# EAGLE design TDC1000_Front_End_AutoRoute (EAGLE 9.3.0)
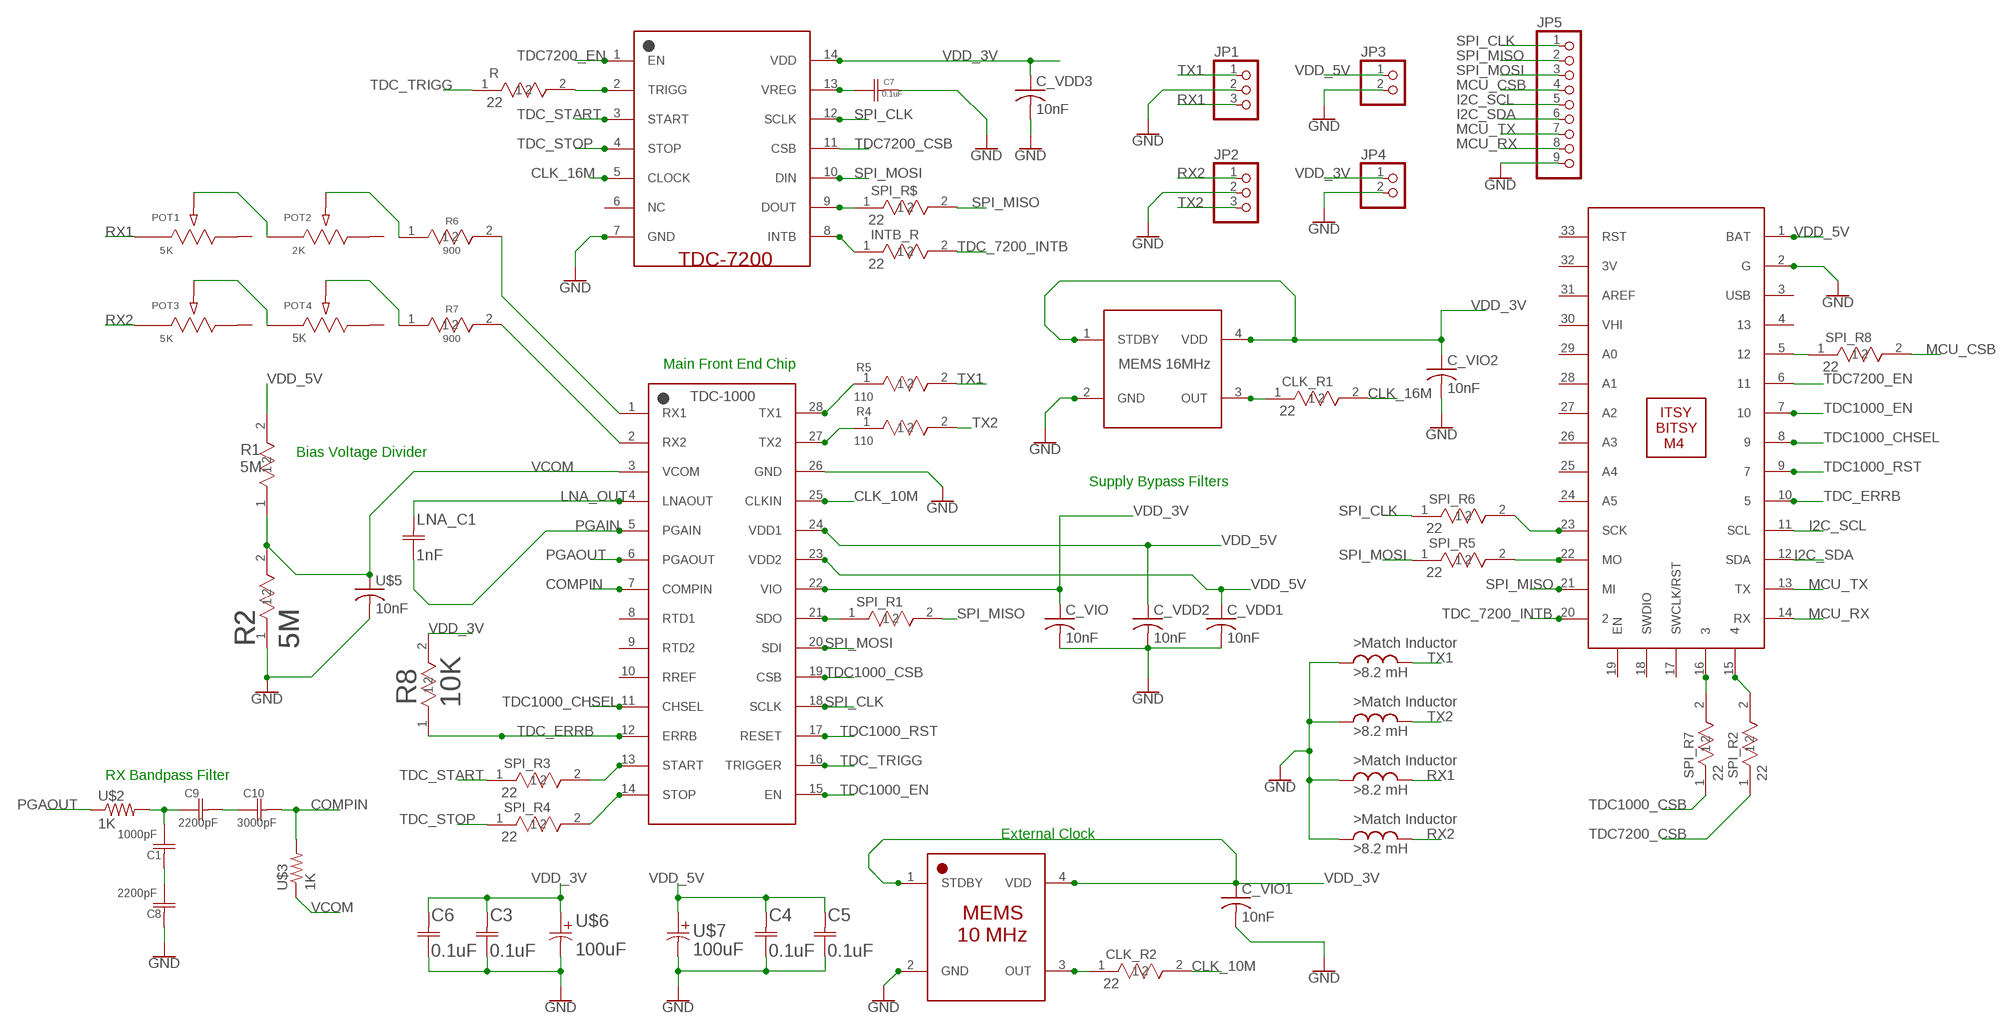
[diagram p0: schematic, sheet 1]

## Parts
C1  1000pF  06035C104JAT2A  [0603]
C3  0.1uF  06035C104JAT2A  [0603]
C4  0.1uF  06035C104JAT2A  [0603]
C5  0.1uF  06035C104JAT2A  [0603]
C6  0.1uF  06035C104JAT2A  [0603]
C7  0.1uF  06035C104JAT2A  [0603]
C8  2200pF  06035C104JAT2A  [0603]
C9  2200pF  06035C104JAT2A  [0603]
C10  3000pF  06035C104JAT2A  [0603]
C_VDD1  10nF  CL05B103KB5NNNC  [CL05B103KB5NNNC]
C_VDD2  10nF  CL05B103KB5NNNC  [CL05B103KB5NNNC]
C_VDD3  10nF  CL05B103KB5NNNC  [CL05B103KB5NNNC]
C_VIO  10nF  CL05B103KB5NNNC  [CL05B103KB5NNNC]
C_VIO1  10nF  CL05B103KB5NNNC  [CL05B103KB5NNNC]
C_VIO2  10nF  CL05B103KB5NNNC  [CL05B103KB5NNNC]
CLK_R1  22  MMB02070C2209FB200  [MMB0207]
CLK_R2  22  MMB02070C2209FB200  [MMB0207]
INTB_R  22  MMB02070C2209FB200  [MMB0207]
JP1  PINHD-1X3/90  [1X03/90]
JP2  PINHD-1X3/90  [1X03/90]
JP3  PINHD-1X2/90  [1X02/90]
JP4  PINHD-1X2/90  [1X02/90]
JP5  PINHD-1X9  [1X09]
LNA_C1  1nF  06035C104JAT2A  [0603]
POT1  5K  3362P-1-502LF  [POT_3362P]
POT2  2K  3362P-1-502LF  [POT_3362P]
POT3  5K  3362P-1-502LF  [POT_3362P]
POT4  5K  3362P-1-502LF  [POT_3362P]
R  22  MMB02070C2209FB200  [MMB0207]
R1  5M  PAT1206E9000BST1  [1206]
R2  5M  PAT1206E9000BST1  [1206]
R4  110  RR1220P-111-D  [RES_1220]
R5  110  RR1220P-111-D  [RES_1220]
R6  900  PAT1206E9000BST1  [1206]
R7  900  PAT1206E9000BST1  [1206]
R8  10K  RR0816P-103-D  [RES_0816]
SPI_R1  22  MMB02070C2209FB200  [MMB0207]
SPI_R2  22  MMB02070C2209FB200  [MMB0207]
SPI_R3  22  MMB02070C2209FB200  [MMB0207]
SPI_R4  22  MMB02070C2209FB200  [MMB0207]
SPI_R5  22  MMB02070C2209FB200  [MMB0207]
SPI_R6  22  MMB02070C2209FB200  [MMB0207]
SPI_R7  22  MMB02070C2209FB200  [MMB0207]
SPI_R8  22  MMB02070C2209FB200  [MMB0207]
SPI_R$  22  MMB02070C2209FB200  [MMB0207]
U$1  TDC1000_TSSOP  [TDC1000_TSSOP]
U$2  1K  ESR03_1K_RESISTOR  [ROHM_ESR03]
U$3  1K  ESR03_1K_RESISTOR  [ROHM_ESR03]
U$4  DSC1001CL5-010.0000_2.5X10MHZ_2.5X3.2MM  [DSC1001CL5-010.0000_2.5X3.2MM]
U$5  10nF  CL05B103KB5NNNC  [CL05B103KB5NNNC]
U$6  100uF  UKL1E101KPDANATA_100UF_CAP  [UKL1E101KPDANATA_100UF]
U$7  100uF  UKL1E101KPDANATA_100UF_CAP  [UKL1E101KPDANATA_100UF]
U$8  TDC7200_TSSOPTSSOP-14  [TDC7200_TSSOP]
U$9  DSC1001BL5-016.0000_5X3.2MM  [DSC1001BL5-016.0000_5X3.2MM]
U$10  ITSY_BITSY_M4  [ITSY_BITSY_M4]
U$11  AIUR_16_8.2MH_INDUCTOR  [AIUR-16_8MH_INDUCTOR]
U$12  AIUR_16_8.2MH_INDUCTOR  [AIUR-16_8MH_INDUCTOR]
U$13  AIUR_16_8.2MH_INDUCTOR  [AIUR-16_8MH_INDUCTOR]
U$14  AIUR_16_8.2MH_INDUCTOR  [AIUR-16_8MH_INDUCTOR]

## Nets
CLK_10M: CLK_R2.2 U$1.25(CLKIN)
CLK_16M: CLK_R1.2 U$8.5(CLOCK)
COMPIN: C10.2 U$1.7(COMPIN) U$3.P$2
GND: C3.1 C4.1 C5.1 C6.1 C7.2 C8.2 C_VDD1.2 C_VDD2.2 C_VDD3.2 C_VIO1.2 C_VIO2.2 C_VIO.2 JP1.2 JP2.2 JP3.2 JP4.2 JP5.9 R2.1 U$1.26(GND) U$4.2(GND) U$5.2 U$6.1 U$7.1 U$8.7(GND) U$9.2(GND) U$10.2(G) U$11.1 U$12.1 U$13.1 U$14.1
I2C_SCL: JP5.5 U$10.11(SCL)
I2C_SDA: JP5.6 U$10.12(SDA)
LNA_OUT: LNA_C1.2 U$1.4(LNAOUT)
MCU_CSB: JP5.4 SPI_R8.2
MCU_RX: JP5.8 U$10.14(RX)
MCU_TX: JP5.7 U$10.13(TX)
N$1: SPI_R1.1 U$1.21(SDO)
N$2: SPI_R2.2 U$10.15
N$3: R.2 U$8.2(TRIGG)
N$4: SPI_R3.2 U$1.13(START)
N$5: SPI_R8.1 U$10.5
N$6: CLK_R2.1 U$4.3(OUT)
N$8: C1.1 C9.1 U$2.P$2
N$9: R5.1 U$1.28(TX1)
N$10: C9.2 C10.1
N$11: R4.1 U$1.27(TX2)
N$12: SPI_R4.2 U$1.14(STOP)
N$13: SPI_R$.1 U$8.9(DOUT)
N$14: INTB_R.1 U$8.8(INTB)
N$15: SPI_R6.2 U$10.23(SCK)
N$16: SPI_R5.2 U$10.22(MO)
N$17: CLK_R1.1 U$9.3(OUT)
N$18: C7.1 U$8.13(VREG)
N$19: SPI_R7.2 U$10.16
N$20: POT4.2 R7.1
N$21: POT3.2 POT4.1
N$22: R7.2 U$1.2(RX2)
N$23: R6.2 U$1.1(RX1)
N$24: POT1.2 POT2.1
N$25: POT2.2 R6.1
N$26: C1.2 C8.1
PGAIN: LNA_C1.1 U$1.5(PGAIN)
PGAOUT: U$1.6(PGAOUT) U$2.P$1
RX1: JP1.3 POT1.1 U$14.2
RX2: JP2.1 POT3.1 U$13.2
SPI_CLK: JP5.1 SPI_R6.1 U$1.18(SCLK) U$8.12(SCLK)
SPI_MISO: JP5.2 SPI_R1.2 SPI_R$.2 U$10.21(MI)
SPI_MOSI: JP5.3 SPI_R5.1 U$1.20(SDI) U$8.10(DIN)
TDC1000_CHSEL: U$1.11(CHSEL) U$10.8
TDC1000_CSB: SPI_R7.1 U$1.19(CSB)
TDC1000_EN: U$1.15(EN) U$10.7
TDC1000_RST: U$1.17(RESET) U$10.9
TDC7200_CSB: SPI_R2.1 U$8.11(CSB)
TDC7200_EN: U$8.1(EN) U$10.6
TDC_7200_INTB: INTB_R.2 U$10.20
TDC_ERRB: R8.1 U$1.12(ERRB) U$10.10
TDC_START: SPI_R3.1 U$8.3(START)
TDC_STOP: SPI_R4.1 U$8.4(STOP)
TDC_TRIGG: R.1 U$1.16(TRIGGER)
TX1: JP1.1 R5.2 U$12.2
TX2: JP2.3 R4.2 U$11.2
VCOM: R1.1 R2.2 U$1.3(VCOM) U$3.P$1 U$5.1
VDD_3V: C3.2 C6.2 C_VDD3.1 C_VIO1.1 C_VIO2.1 C_VIO.1 JP4.1 R8.2 U$1.22(VIO) U$4.1(STDBY) U$4.4(VDD) U$6.2 U$8.14(VDD) U$9.1(STDBY) U$9.4(VDD)
VDD_5V: C4.2 C5.2 C_VDD1.1 C_VDD2.1 JP3.1 R1.2 U$1.23(VDD2) U$1.24(VDD1) U$7.2 U$10.1(BAT)
Unconnected: POT1.3 POT2.3 POT3.3 POT4.3 U$1.8(RTD1) U$1.9(RTD2) U$1.10(RREF) U$8.6(NC) U$10.3(USB) U$10.4 U$10.17(SWCLK/RST) U$10.18(SWDIO) U$10.19(EN) U$10.24(A5) U$10.25(A4) U$10.26(A3) U$10.27(A2) U$10.28(A1) U$10.29(A0) U$10.30(VHI) U$10.31(AREF) U$10.32(3V) U$10.33(RST)

## Notes on the sheet
- Main Front End Chip
- Bias Voltage Divider
- Supply Bypass Filters
- RX Bandpass Filter
- External Clock

## Library data of the parts
C1 C3-C10 LNA_C1 = Ultrasonic Misc PieceParts:06035C104JAT2A; MANUFACTURER_PART_NUMBER: 06035C104JAT2A; VENDOR: AVX Corporation
C_VDD1-C_VDD3 C_VIO C_VIO1 C_VIO2 U$5 = Ultrasonic Misc PieceParts:CL05B103KB5NNNC
CLK_R1 CLK_R2 INTB_R R SPI_R1-SPI_R8 SPI_R$ = Ultrasonic Misc PieceParts:MMB02070C2209FB200; MANUFACTURER_PART_NUMBER: MMB02070C2209FB200; VENDOR: Vishay
JP1 JP2 = pinhead:PINHD-1X3: PIN HEADER
JP3 JP4 = pinhead:PINHD-1X2: PIN HEADER
JP5 = pinhead:PINHD-1X9: PIN HEADER
POT1-POT4 = Ultrasonic Misc PieceParts:3362P-1-502LF; MANUFACTURER_PART_NUMBER: 3362P1502LF; VENDOR: Bourns Electronics
R1 R2 R6 R7 = Ultrasonic Misc PieceParts:PAT1206E9000BST1; MANUFACTURER_PART_NUMBER: PAT1206E9000BST1; VENDOR: Vishay
R4 R5 = Ultrasonic Misc PieceParts:RR1220P-111-D; MANUFACTURER_PART_NUMBER: RR1220P111D; VENDOR: Susumu
R8 = Ultrasonic Misc PieceParts:RR0816P-103-D; MANUFACTURER_PART_NUMBER: RR0816P103D; VENDOR: Susumu
U$1 = Texas Instruments:TDC1000_TSSOP
U$2 U$3 = Ultrasonic Misc PieceParts:ESR03_1K_RESISTOR
U$4 = MicroChip Technology:DSC1001CL5-010.0000_2.5X
U$6 U$7 = Ultrasonic Misc PieceParts:UKL1E101KPDANATA_100UF_CAP
U$8 = Texas Instruments:TDC7200_TSSOP
U$9 = MicroChip Technology:DSC1001BL5-016.0000_5X3.2MM: A 16MHz MEMS Oscillator (5x3.2mm) by MicroChip Technology
U$10 = Adafruit_Arduino:ITSY_BITSY_M4
U$11-U$14 = Ultrasonic Misc PieceParts:AIUR_16_8.2MH_INDUCTOR

## Board
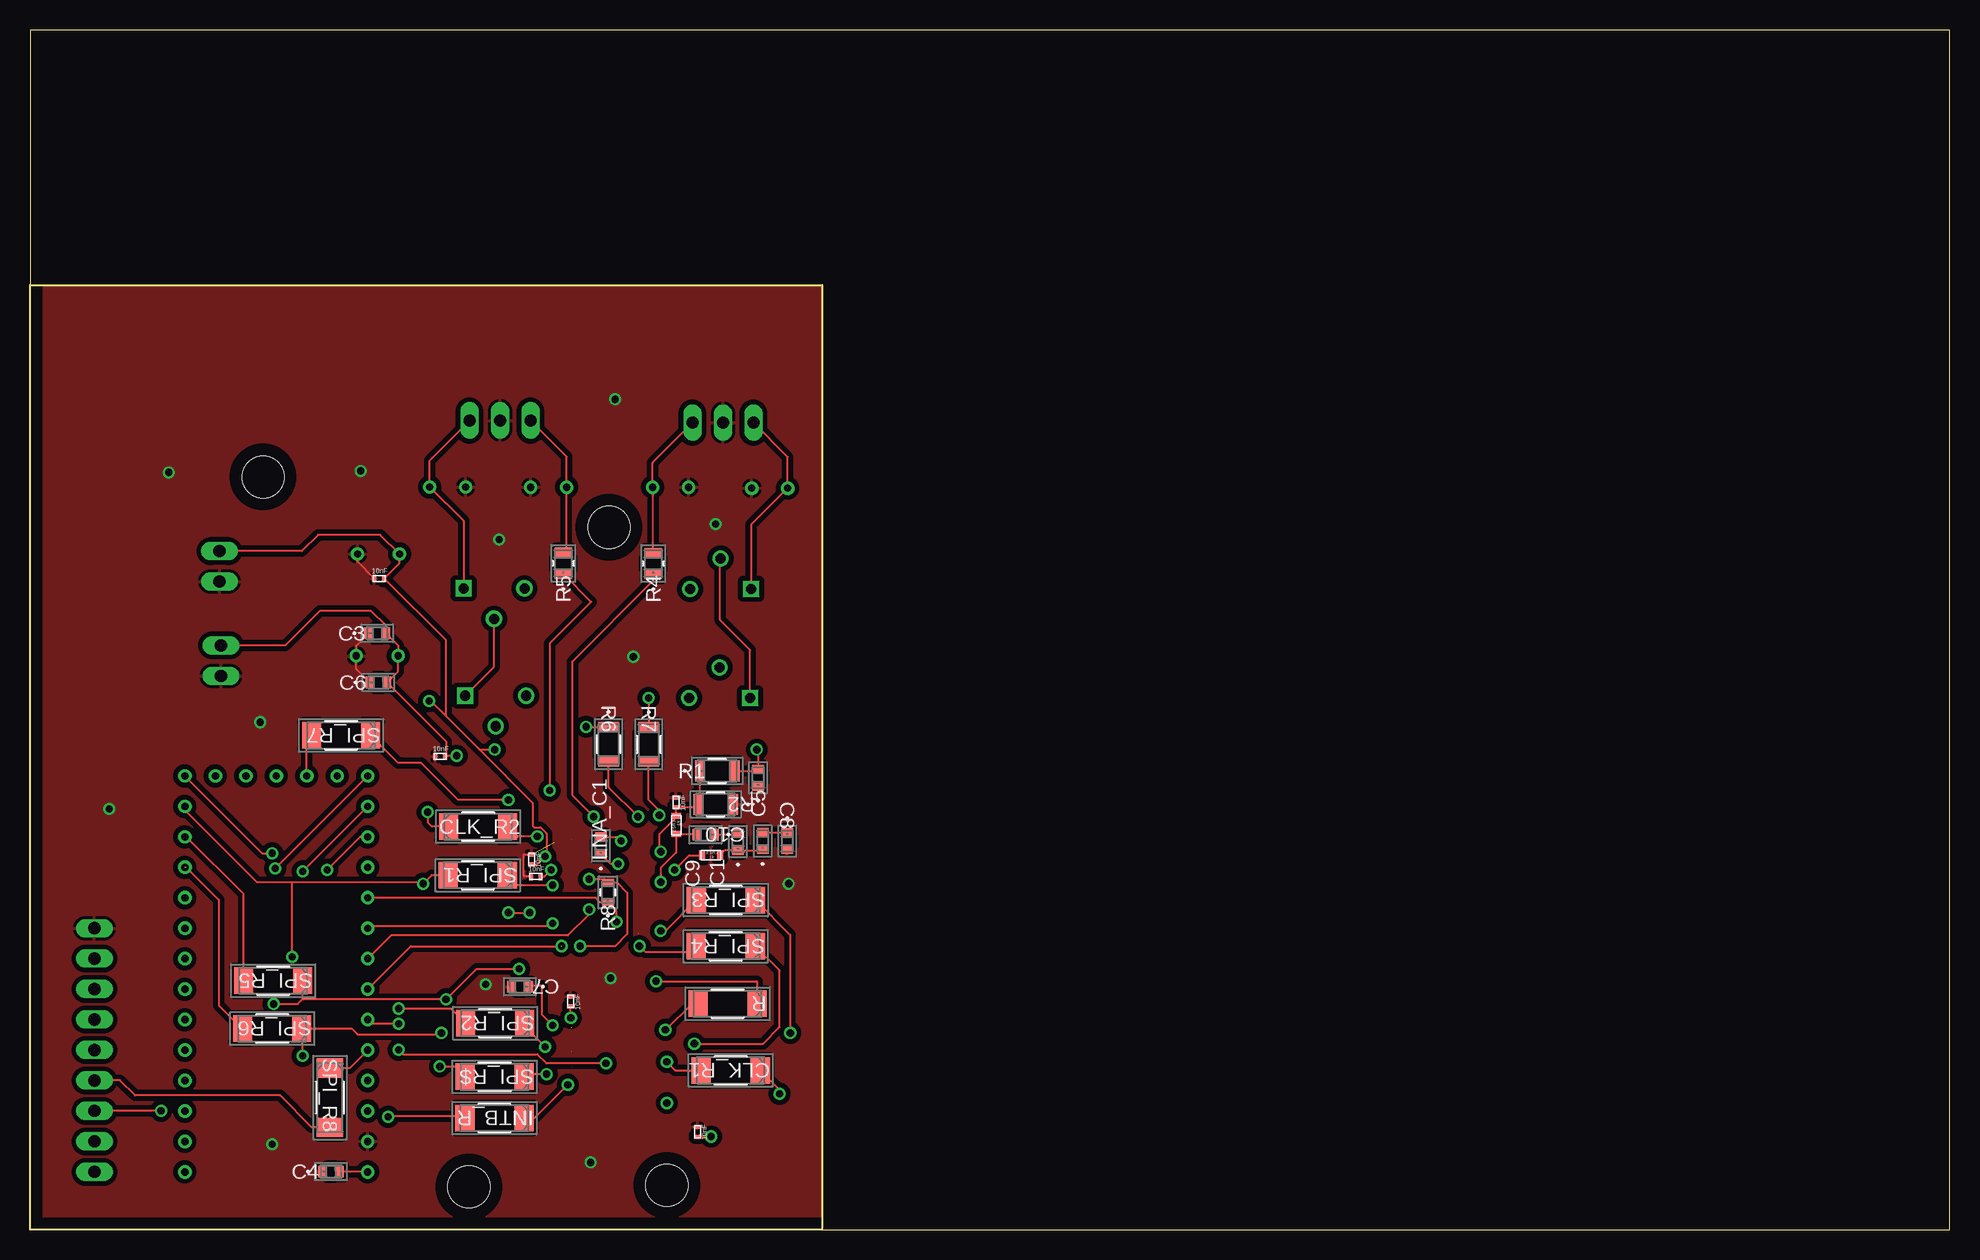
[diagram p1: board, top side]
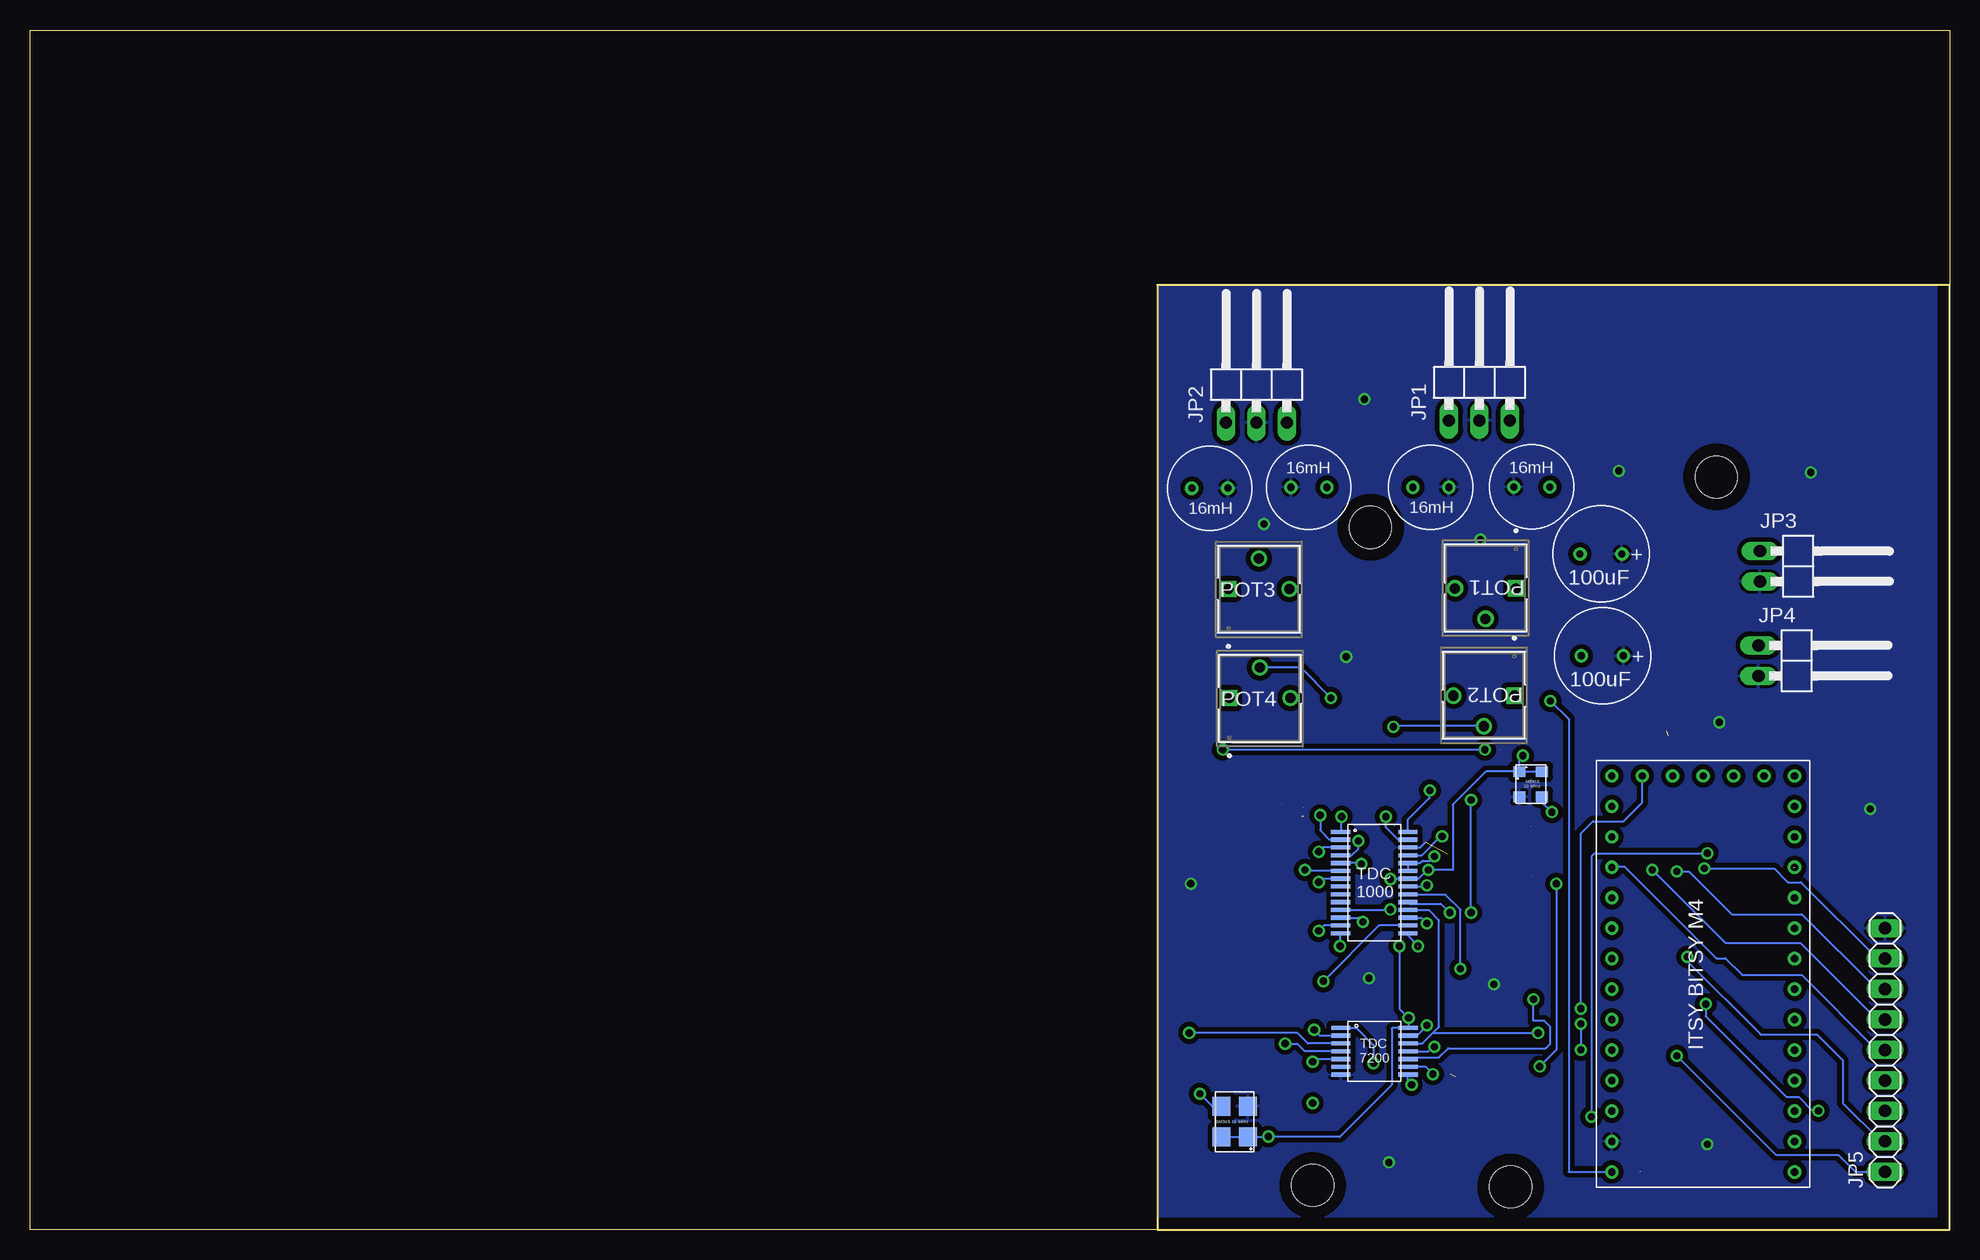
[diagram p2: board, bottom side, seen from below]

Size 160 x 100 mm. Coordinates in mm from the lower left corner, seen from the top.
Outline: 0,0 160,0 160,100 0,100 0,0
Copper layers (1*16): Top 0.035mm / dielectric 1.5mm / Bottom 0.035mm
Design rules "default *": minimum track width 5mil, minimum drill 0.35mm, track to track 5mil, track to pad 5mil, pad to pad 5mil, via to via 5mil, smd to smd 5mil, copper to edge 40mil, drill to drill 6mil, minimum pad ring 10mil, minimum via ring 8mil, stop-mask expansion 4mil, vias tented up to drill 0mil, thermal gap 10mil
Holes 3.5 mm at 36.58,3.56 48.26,58.55 53.09,3.68 19.43,62.74
Milling: 4 lines

### Footprints (pad centres in the part's own frame; a part is rotated, then mirrored left to right if it is on the bottom)
0603 = smd 0.711 x 0.965: 1 -0.724,0; 2 0.724,0
CL05B103KB5NNNC = smd 0.33 x 0.6: 1 -0.415,0; 2 0.415,0
MMB0207 = smd 1.6 x 2.21: 1 -2.464,0; 2 2.464,0
1X03/90 = drill 1.016 long: 1 -2.54,-3.81; 2 0,-3.81; 3 2.54,-3.81
1X02/90 = drill 1.016 long: 1 -1.27,-3.81; 2 1.27,-3.81
1X09 = drill 1.016 long: 1 -10.16,0; 2 -7.62,0; 3 -5.08,0; 4 -2.54,0; 5 0,0; 6 2.54,0; 7 5.08,0; 8 7.62,0; 9 10.16,0
POT_3362P = drill 0.838 pad 1.346 square: 1 -5.08,0.076 | drill 0.838 pad 1.346: 2 -2.54,2.616; 3 0,0.076
1206 = smd 0.803 x 1.75: 1 -1.452,0; 2 1.452,0
RES_1220 = smd 0.803 x 1.45: 1 -0.902,0; 2 0.902,0
RES_0816 = smd 0.553 x 1: 1 -0.827,0; 2 0.827,0
TDC1000_TSSOP = smd 1.6 x 0.35: 1 -2.8,4.225; 2 -2.8,3.575; 3 -2.8,2.925; 4 -2.8,2.275; 5 -2.8,1.625; 6 -2.8,0.975; 7 -2.8,0.325; 8 -2.8,-0.325; 9 -2.8,-0.975; 10 -2.8,-1.625; 11 -2.8,-2.275; 12 -2.8,-2.925; 13 -2.8,-3.575; 14 -2.8,-4.225; 15 2.8,-4.225; 16 2.8,-3.575; 17 2.8,-2.925; 18 2.8,-2.275; 19 2.8,-1.625; 20 2.8,-0.975; 21 2.8,-0.325; 22 2.8,0.325; 23 2.8,0.975; 24 2.8,1.625; 25 2.8,2.275; 26 2.8,2.925; 27 2.8,3.575; 28 2.8,4.225
ROHM_ESR03 = smd 0.5 x 0.8: P$1 -0.75,0; P$2 0.75,0
DSC1001CL5-010.0000_2.5X3.2MM = smd 1 x 0.9: 1 -0.95,1.05; 2 -0.95,-1.05; 3 0.95,-1.05; 4 0.95,1.05
UKL1E101KPDANATA_100UF = drill 0.6: 1 -1.75,0; 2 1.75,0
TDC7200_TSSOP = smd 1.6 x 0.35: 1 -2.8,1.95; 2 -2.8,1.3; 3 -2.8,0.65; 4 -2.8,0; 5 -2.8,-0.65; 6 -2.8,-1.3; 7 -2.8,-1.95; 8 2.8,-1.95; 9 2.8,-1.3; 10 2.8,-0.65; 11 2.8,0; 12 2.8,0.65; 13 2.8,1.3; 14 2.8,1.95
DSC1001BL5-016.0000_5X3.2MM = smd 1.5 x 1.6: 1 -1.1,1.27; 2 -1.1,-1.27; 3 1.1,-1.27; 4 1.1,1.27
ITSY_BITSY_M4 = drill 0.6: 1 -16.51,7.62; 2 -13.97,7.62; 3 -11.43,7.62; 4 -8.89,7.62; 5 -6.35,7.62; 6 -3.81,7.62; 7 -1.27,7.62; 8 1.27,7.62; 9 3.81,7.62; 10 6.35,7.62; 11 8.89,7.62; 12 11.43,7.62; 13 13.97,7.62; 14 16.51,7.62; 15 16.51,5.08; 16 16.51,2.54; 17 16.51,0; 18 16.51,-2.54; 19 16.51,-5.08; 20 16.51,-7.62; 21 13.97,-7.62; 22 11.43,-7.62; 23 8.89,-7.62; 24 6.35,-7.62; 25 3.81,-7.62; 26 1.27,-7.62; 27 -1.27,-7.62; 28 -3.81,-7.62; 29 -6.35,-7.62; 30 -8.89,-7.62; 31 -11.43,-7.62; 32 -13.97,-7.62; 33 -16.51,-7.62
AIUR-16_8MH_INDUCTOR = drill 0.6: 1 -1.5,0; 2 1.5,0

### Placement (x,y rotation side)
C1  61.07,32.39 90 top
C3  28.95,49.71 0 top
C4  25.08,4.84 0 top
C5  60.69,37.66 90 top
C6  29.04,45.6 0 top
C7  40.84,20.24 180 top
C8  63.12,32.38 270 top
C9  59.01,32.33 90 top
C10  56.31,32.92 180 top
C_VDD1  29.11,54.28 180 top
C_VDD2  41.81,30.86 90 top
C_VDD3  45.08,19 90 top
C_VIO  34.2,39.44 180 top
C_VIO1  42.17,29.42 180 top
C_VIO2  55.64,8.15 90 top
CLK_R1  58.4,13.27 180 top
CLK_R2  37.36,33.6 0 top
INTB_R  38.72,9.29 180 top
JP1  39.18,71.26 0 bottom
JP2  57.77,71.07 0 bottom
JP3  11.99,55.29 270 bottom
JP4  12.11,47.42 270 bottom
JP5  5.37,14.96 90 bottom
LNA_C1  47.58,32.01 90 top
POT1  41.21,53.53 180 bottom
POT2  41.35,44.58 180 bottom
POT3  55.03,53.33 0 bottom
POT4  54.95,44.23 0 bottom
R  58.14,18.82 180 top
R1  57.28,38.24 0 top
R2  57.15,35.44 180 top
R4  51.95,55.52 90 top
R5  44.45,55.53 90 top
R6  48.23,40.46 270 top
R7  51.58,40.45 270 top
R8  48.17,28.11 90 top
SPI_R1  37.33,29.53 180 top
SPI_R2  38.77,17.2 180 top
SPI_R3  58,27.47 180 top
SPI_R4  57.99,23.61 180 top
SPI_R5  20.27,20.74 180 top
SPI_R6  20.19,16.76 180 top
SPI_R7  25.94,41.19 180 top
SPI_R8  25,10.99 270 top
SPI_R$  38.73,12.73 180 top
U$1  47.95,28.92 0 bottom
U$2  56.76,31.21 0 top
U$3  53.86,33.71 270 top
U$4  34.92,37.12 0 bottom
U$5  53.85,35.61 90 top
U$6  28.93,47.83 180 bottom
U$7  29.05,56.31 180 bottom
U$8  47.93,14.86 0 bottom
U$9  59.58,8.99 180 bottom
U$10  20.53,21.31 90 bottom
U$11  53.4,61.88 0 bottom
U$12  43.24,61.88 180 bottom
U$13  61.66,61.8 180 bottom
U$14  34.81,61.9 0 bottom

### Tracks (layer width: path | path; a pad name or v marks a point on that pad's centre or on a via)
CLK_10M  (via drill 0.6)
  Top 0.152: v42.29,32.77 40.65,32.77 CLK_R2.2
  Bottom 0.152: U$1.25 43.99,31.19 42.42,32.77 v42.29,32.77
CLK_16M  (via drill 0.6)  (1 unrouted)
  Top 0.152: 55.43,13.27 CLK_R1.2 53.79,13.27 v53.09,13.97
  Bottom 0.152: U$8.5 50.74,14.22 52.83,14.22 v53.09,13.97
COMPIN  (via drill 0.6)
  Top 0.152: C10.2 55.55,32.96 U$3.P$2 53.86,31.43 52.58,30.15 v52.58,28.96
  Bottom 0.152: U$1.7 52.29,29.24 v52.58,28.96
GND  (via drill 0.6)  (1 unrouted)
  Top 0.152: C_VIO1.2 41.19,29.42 41.15,29.46 41.15,31.24 41.19,31.28 C_VDD2.2 | C6.1 27.18,46.73 U$6.1 27.18,48.67 C3.1 | C_VDD1.2 27.3,55.67 U$7.1
  Bottom 0.152: 44.36,31.84 U$1.26 44.1,31.84 43.69,32.26
  other vias: 37.97,20.45 6.6,35.05 19.18,42.29 11.56,63.12 27.56,63.25 48.77,69.22 57.15,58.8 50.29,47.75 39.12,57.53 20.19,7.11 46.74,5.59 48.39,20.95 63.25,28.83
  pour Bottom (isolate 0.406): 0,0 0,78.74 66.04,78.74 66.04,0
  pour Top (isolate 0.406): 0,0 0,78.74 66.04,78.74 66.04,0
I2C_SCL  (2 unrouted)
  Bottom 0.152: 5.33,14.99 6.1,14.99 12.32,21.21 17.27,21.21 18.67,22.61 19.43,22.61 27.05,30.23 28.12,30.23 U$10.11
I2C_SDA  (via drill 0.6)  (1 unrouted)
  Top 0.152: 24.77,29.98 v24.77,29.97 27.53,32.74 U$10.12
  Bottom 0.152: JP5.6 6.07,17.5 12.45,23.88 18.67,23.88 v24.77,29.97
LNA_OUT  (via drill 0.6)
  Top 0.152: LNA_C1.2 48.93,32.73 v49.28,32.38
  Bottom 0.152: U$1.4 49.83,31.19 49.28,31.75 v49.28,32.38
MCU_CSB
  Top 0.152: SPI_R8.2 23.48,8.53 20.83,11.18 8.76,11.18 7.49,12.45 5.39,12.45 JP5.4
MCU_RX  (via drill 0.6)  (1 unrouted)
  Top 0.152: v20.45,30.1 | v20.45,30.1 28.15,37.8 U$10.14
  Bottom 0.152: v20.45,30.1 14.61,30.1 13.46,28.96 12.38,28.96 6.01,22.58 JP5.8
MCU_TX  (via drill 0.6)  (2 unrouted)
  Top 0.152: U$10.13 22.73,29.86 v22.73,29.84
  Bottom 0.152: v22.73,29.84 21.72,29.84 18.16,26.29 12.32,26.29 6.07,20.04 JP5.7
N$1  (via drill 0.6)
  Top 0.152: v43.56,28.7 40.62,28.7 SPI_R1.1
  Bottom 0.152: U$1.21 43.56,28.59 v43.56,28.7
N$2  (via drill 0.6)
  Top 0.152: SPI_R2.2 35.09,18.41 v30.73,18.41
  Bottom 0.152: v30.73,18.41 30.73,33.02 29.72,34.04 27.18,34.04 25.61,35.6 U$10.15
N$3  (via drill 0.6)
  Top 0.152: v52.96,16.64 52.98,16.64 55.17,18.82 R.2
  Bottom 0.152: U$8.2 52.48,16.16 v52.96,16.64
N$4  (via drill 0.6)
  Top 0.152: v52.58,24.89 52.96,24.89 SPI_R3.2
  Bottom 0.152: U$1.13 52.13,25.34 v52.58,24.89
N$5
  Top 0.152: U$10.5 26.65,13.46 SPI_R8.1
N$6  (via drill 0.6)  (1 unrouted)
  Top 0.152: 34.9,33.66 CLK_R2.1 33.5,33.6 33.15,33.95 v33.15,34.8
  Bottom 0.152: U$4.3 33.97,35.62 v33.15,34.8
N$8
  Top 0.152: U$2.P$2 57.91,31.61 C9.1 61.01,31.61 C1.1
N$9  (via drill 0.6)  (1 unrouted)
  Top 0.152: R5.1 44.48,54.63 46.79,52.32 43.32,48.86 v43.32,36.61
  Bottom 0.152: U$1.28 45.18,33.17 45.18,34.13 43.34,35.97 v43.33,36.61
N$10
  Top 0.152: C10.1 58.88,32.92 C9.2
N$11  (via drill 0.6)  (1 unrouted)
  Top 0.152: v46.99,34.42 45.21,36.2 45.21,47.37 51.95,54.11 R4.1
  Bottom 0.152: U$1.27 45.95,32.49 46.99,33.53 v46.99,34.42
N$12  (via drill 0.6)  (1 unrouted)
  Top 0.152: v50.8,23.62 51.31,23.11 55.03,23.11 SPI_R4.2
  Bottom 0.152: U$1.14 50.8,24.64 v50.8,23.62
N$13  (via drill 0.6)  (2 unrouted)
  Top 0.152: v43.05,12.95 41.61,12.95 41.2,13.37
  Bottom 0.152: v43.05,12.95 43.66,13.56 U$8.9
N$14  (via drill 0.6)
  Top 0.152: v44.83,12.06 42.06,9.29 INTB_R.1
  Bottom 0.152: v44.83,12.06 45.13,12.36 U$8.8
N$15  (1 unrouted)
  Top 0.152: 13.04,30.2 15.75,27.49 15.75,18.67 17.65,16.76 SPI_R6.2
N$16
  Top 0.152: SPI_R5.2 17.81,27.96 13.04,32.74 U$10.22
N$17  (via drill 0.6)
  Top 0.152: CLK_R1.1 62.48,11.65 v62.48,11.3
  Bottom 0.152: v62.48,11.3 61.44,10.26 U$9.3
N$18  (via drill 0.6)
  Top 0.152: v43.56,17.02 42.67,17.91 42.67,20.32 41.64,20.32 C7.1
  Bottom 0.152: U$8.13 44.42,16.16 v43.56,17.02
N$19  (1 unrouted)
  Top 0.152: U$10.16 23.07,41.04 23.6,41.57
N$20  (via drill 0.6)
  Top 0.152: v51.56,44.32 51.56,41.91 R7.1
  Bottom 0.152: v51.56,44.32 54.08,46.84 POT4.2
N$21
  Top 0.152: POT4.1 60.03,48.3 57.53,50.8 57.53,55.91 POT3.2
N$22  (via drill 0.6)
  Top 0.152: v52.45,34.54 52.45,34.92 51.58,35.8 R7.2
  Bottom 0.152: v52.45,34.54 52.45,33.27 51.67,32.49 U$1.2
N$23  (via drill 0.6)  (1 unrouted)
  Top 0.152: v50.67,34.42 48.23,36.86 R6.2
  Bottom 0.152: v50.67,34.42 50.74,34.34 U$1.1
N$24
  Top 0.152: POT2.1 38.67,46.9 POT1.2
N$25  (via drill 0.6)
  Top 0.152: v46.35,41.91 v46.36,41.91 R6.1
  Bottom 0.152: POT2.2 46.31,41.96 v46.35,41.91
N$26
  Top 0.152: C1.2 C8.1
N$28  (via drill 0.6)
  other vias: 53.09,10.54
PGAIN  (via drill 0.6)
  Top 0.152: v49.02,30.48 48.38,30.48 LNA_C1.1
  Bottom 0.152: v49.02,30.48 49.08,30.54 U$1.5
PGAOUT  (via drill 0.6)
  Top 0.152: v53.72,29.97 54.96,31.21 U$2.P$1
  Bottom 0.152: U$1.6 53.64,29.89 v53.72,29.97
RX1
  Top 0.152: POT1.1 36.13,59.09 U$14.2 33.31,64.12 JP1.3
RX2  (2 unrouted)
  Top 0.152: POT3.1 60.11,58.76 U$13.2 63.16,64.42 JP2.1
SPI_CLK  (via drill 0.6)
  Top 0.152: SPI_R6.1 22.73,16.76 | 22.73,16.76 26.8,16.76 27.3,16.26 34.16,16.26 v34.29,16.38 | v22.73,14.48 22.73,16.76
  Bottom 0.152: U$8.12 43.92,15.51 43.05,16.38 | 43.05,16.38 42.55,16.89 42.55,25.78 43.41,26.64 U$1.18 | 43.05,16.38 v34.29,16.38 | v22.73,14.48 14.48,6.22 9.27,6.22 7.85,4.8 JP5.1
SPI_MISO  (via drill 0.6)  (4 unrouted)
  Top 0.152: SPI_R1.2 33.47,29.53 v32.77,28.83 32.64,28.96 21.84,28.96 | 21.84,28.96 18.92,28.96 12.91,34.97 U$10.21 | v21.84,22.73 21.84,28.96 | v34.16,13.59 35.41,13.59 SPI_R$.2
  Bottom 0.152: v21.84,22.73 21.84,22.35 15.75,16.26 11.05,16.26 8.89,14.1 8.89,10.54 5.69,7.34 JP5.2 | v34.16,13.59 32.77,14.99 v32.77,28.83
SPI_MOSI  (via drill 0.6)  (1 unrouted)
  Top 0.152: 22.74,19.22 22.78,19.18 v34.67,19.18 37.21,21.72 v40.77,21.72 | v20.32,18.8 22.32,18.8 22.74,19.22 | 22.74,19.22 SPI_R5.1 | v10.92,9.91 5.39,9.91 JP5.3
  Bottom 0.152: U$8.10 45,14.34 42.56,14.34 41.78,15.11 33.66,15.11 33.27,15.49 33.27,16.89 33.78,17.4 34.67,17.4 v34.67,19.18 | U$1.20 45.11,27.91 | 45.11,27.91 45.02,27.81 | v20.32,18.8 20.32,17.78 13.59,11.05 12.57,11.05 11.43,9.91 v10.92,9.91 | v40.77,21.72 40.77,26.67 42.01,27.91 45.11,27.91
TDC1000_CHSEL  (via drill 0.6)  (1 unrouted)
  Top 0.152: v46.61,26.67 46.61,26.29 44.83,24.51 30.09,24.51 U$10.8
  Bottom 0.152: U$1.11 46.64,26.64 v46.61,26.67
TDC1000_CSB  (via drill 0.6)
  Top 0.152: v39.88,26.42 v41.66,26.42 | SPI_R7.1 30.69,38.91 32.6,38.91 35.69,35.81 v39.88,35.81
  Bottom 0.152: v41.66,26.42 42.41,27.16 45.02,27.16 U$1.19 | v39.88,26.42 v39.88,35.81
TDC1000_EN  (via drill 0.6)  (1 unrouted)
  Top 0.152: U$10.7 31.74,23.62 v44.32,23.62
  Bottom 0.152: U$1.15 45.15,24.51 44.31,23.64
TDC1000_RST  (via drill 0.6)
  Top 0.152: v43.56,25.53 43.31,25.27 28.31,25.27 U$10.9
  Bottom 0.152: U$1.17 44.03,25.99 v43.56,25.53
TDC7200_CSB  (via drill 0.6)  (1 unrouted)
  Top 0.152: v42.93,15.24 41.23,16.93 SPI_R2.1
  Bottom 0.152: U$8.11 43.43,14.86 43.05,15.24 v42.93,15.24
TDC7200_EN  (via drill 0.6)  (1 unrouted)
  Top 0.152: v30.73,17.14 28.5,17.14 U$10.6 | v30.73,14.99 31.11,14.61 42.29,14.61 43.05,13.84 v48.01,13.84
  Bottom 0.152: U$8.1 49.45,16.81 48.01,15.37 v48.01,13.84 | v30.73,17.14 v30.73,14.99
TDC_7200_INTB  (via drill 0.6)  (1 unrouted)
  Top 0.152: U$10.20 19.36,31.37 v20.19,31.37 | INTB_R.2 36.12,9.42 29.87,9.42 v29.84,9.4
  Bottom 0.152: v29.84,9.4 29.84,31.11 29.59,31.37 v20.19,31.37
TDC_ERRB  (via drill 0.6)  (3 unrouted)
  Top 0.152: v48.9,25.65 48.9,26.56 R8.1 47.52,27.28 47.15,27.66 U$10.10
  Bottom 0.152: U$1.12 49.23,25.99 v48.9,25.65
TDC_START  (via drill 0.6)
  Top 0.152: SPI_R3.1 63.37,24.56 v63.37,16.38
  Bottom 0.152: U$8.3 53.49,15.51 54.36,16.38 v63.37,16.38
TDC_STOP  (via drill 0.6)
  Top 0.152: v55.37,15.49 61.09,15.49 62.48,16.89 62.48,21.58 SPI_R4.1
  Bottom 0.152: U$8.4 53.73,14.86 54.36,15.49 v55.37,15.49
TDC_TRIGG  (via drill 0.6)
  Top 0.152: v52.2,20.7 60.58,20.7 60.61,20.67 R.1
  Bottom 0.152: U$1.16 47.56,25.34 v52.2,20.7
TX1
  Top 0.152: R5.2 44.7,56.69 44.7,61.85 U$12.2 44.74,64.43 JP1.1
TX2
  Top 0.152: JP2.3 51.9,63.94 U$11.2 51.95,61.83 R4.2
VCOM  (via drill 0.6)  (3 unrouted)
  Top 0.152: R2.2 55.45,35.2 U$5.1 53.85,34.47 U$3.P$1 | R1.1 55.83,35.57 R2.2 | v52.58,31.5 52.45,31.62 52.45,32.92 53.99,34.46
  Bottom 0.152: U$1.3 52.23,31.84 v52.58,31.5
VDD_3V  (via drill 0.6)  (4 unrouted)
  Top 0.152: v45.09,17.65 v45.08,17.66 C_VDD3.1 | v56.77,7.75 55.65,7.75 C_VIO2.1 | v46.61,29.21 47.89,29.21 R8.2 48.93,28.93 49.78,28.08 49.78,24.64 48.77,23.62 v45.85,23.62 | v35.56,39.5 34.67,39.5 | 34.67,39.5 C_VIO.1 | C_VIO1.1 42.88,29.42 v43.43,29.97 | 34.67,39.5 34.67,40.7 C6.2 30.68,46.53 U$6.2 30.68,48.7 C3.2 29.67,50.34 28.45,51.56 24.13,51.56 21.26,48.69 JP4.1
  Bottom 0.152: 45.1,16.81 45.1,17.65 45.85,18.39 v45.85,23.62 | 56.8,7.72 U$9.1 U$9.4 | 56.8,7.72 v56.77,7.75 | v46.61,29.21 45.18,29.21 U$1.22 44.26,29.24 43.53,29.97 v43.43,29.97 41.4,29.97 41.4,35.43 38.66,38.17 U$4.1 | U$4.1 35.87,39.19 v35.56,39.5 | U$4.1 U$4.4 | U$8.14 46.43,16.81 46.48,16.76 46.48,12.06 50.83,7.72 56.8,7.72
VDD_5V  (via drill 0.6)  (4 unrouted)
  Top 0.152: v42.93,31.11 42.86,31.11 | R1.2 60.54,38.24 C5.2 60.69,39.9 v60.58,40.01 | U$10.1 26.68,4.8 25.82,4.81 C4.2 | C_VDD2.1 42.26,30.45 v42.93,31.11 | 37.47,40.01 34.67,42.8 | 37.47,40.01 41.91,35.56 41.91,33.66 42.04,33.53 42.55,33.53 43.05,33.02 43.05,31.24 v42.93,31.11 | 37.47,40.01 v38.73,40.01 | JP3.1 22.65,56.56 24,57.91 29.21,57.91 U$7.2 30.8,55.55 C_VDD1.1 34.67,49.13 34.67,42.8 | v33.27,44.07 33.4,44.07 34.67,42.8
  Bottom 0.152: U$1.23 U$1.24 44.13,30.54 43.94,30.73 43.31,30.73 v42.93,31.11 | v38.73,40.01 v60.58,40.01 60.71,40.01 | v33.27,44.07 31.75,42.55 31.75,4.8 U$10.1